# EAGLE design Efield1A (EAGLE 6.3)
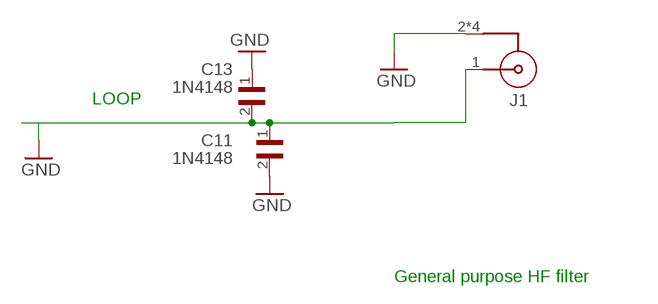
[diagram p0: schematic, sheet 1]

## Parts
C11  1N4148  WCAP-CSGP_0805-REFLOW  [WCAP-CSGP_0805_REFLOW]
C13  1N4148  WCAP-CSGP_0805-REFLOW  [WCAP-CSGP_0805_REFLOW]
J1  60312202114509  [60312202114509]

## Nets
GND: C11.1 C11.2 C13.1 C13.2 J1.1 J1.2 J1.3 J1.4 J1.5

## Notes on the sheet
- LOOP
- General purpose HF filter

## Library data of the parts
C11 C13 = Eagle_Wurth_Elektronik_Passive_Capacitors_rev15a:WCAP-CSGP: WCAP-CSGP Ceramic Capacitors Characteristics Multilayer Ceramic Chip Capacitor Recommended soldering:Reflow, for 0603 and 0805 wave soldering is also allowed Operating temperature:-55 °C to +125 °C; Ceramic characteristics: Class I - NPO ; Class II -X7R, X5R High performance ceramic High capacitance stability Minimal aging Termination:Cu/Ni/Sn <http://katalog.we-online.de/media/images/eisos/WCAP-CSGP_pf2.jpg> Details see: http://katalog.we-online.de/en/pbs/WCAP-CSGP/?m Created: 2015-01-28 2015 (C) Wurth Elektronik
J1 = 60312202111527_Eagle_WR-SMA_rev19a:60312202114509: WR-SMA PCB End Launch Jack Round Post 1.6 mm MATERIAL PROPERTIES Insulator Material PTFE Insulator Color White Center Contact Material Beryllium Copper Center Contact Plating Gold, min. 0.76µm over Nickel Body Material Brass Body Plating Gold, min. 0.076µm over Nickel KIND PROPERTIES Interface MIL-STD-348 Connector Type SMA Gender Jack Orientation Type Straight GENERAL INFORMATION Operating Temperature -65 °C up to +165 °C Compliance RoHS ELECTRICAL PROPERTIES Frequency Range DC~18 GHz MECHANICAL PROPERTIES Mating Cycle 500 Cycles PACKAGING PROPERTIES Packaging Tray <https://katalog.we-online.com/media/images/v2/o122849v209%20WR-SMA_60312202114509.jpg> Details see: https://katalog.we-online.com/en/em/WR-SMA_60312202114509 Updated by Ella Wu 2019-11-07 2019(C) Würth Elektronik; DATASHEET-URL: https://katalog.we-online.com/em/datasheet/60312202114509.pdf; GENDER: Jack; INTERFACE: MIL-STD-348; MOUNT: End Launch; ORIENTATION-TYPE: Straight; PART-NUMBER: 60312202114509; Z: 50Ohm

## Board
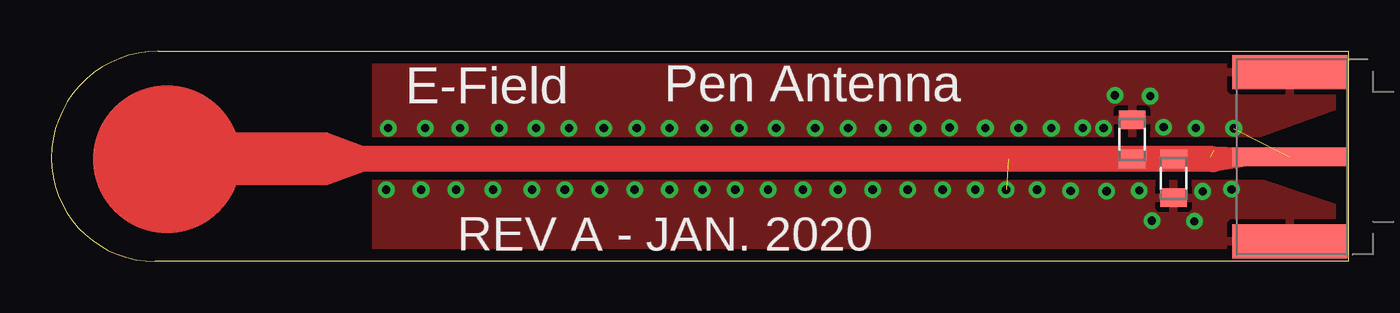
[diagram p1: board, top side]
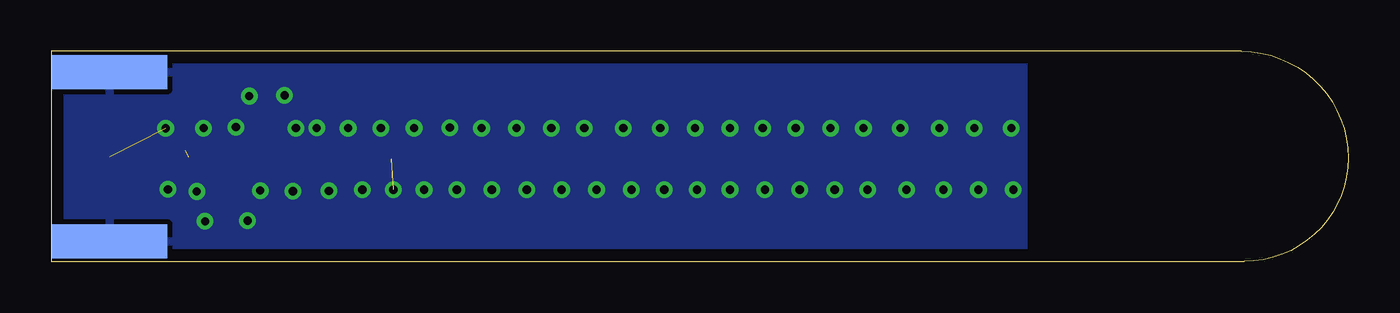
[diagram p2: board, bottom side, seen from below]

Size 63.17 x 10.25 mm. Coordinates in mm from the lower left corner, seen from the top.
Outline: 63.16,0 5.05,0 arc-90 0,5.04 arc-90 5.21,10.25 63.17,10.25 63.17,0.01
Copper layers (1*16): Top 0.035mm / dielectric 1.5mm / Bottom 0.035mm
Design rules "default *": minimum track width 0.2mm, minimum drill 0.3mm, track to track 0.15mm, track to pad 0.15mm, pad to pad 0.15mm, via to via 0.15mm, smd to smd 0.15mm, copper to edge 0.6mm, drill to drill 8mil, minimum pad ring 10mil, minimum via ring 8mil, stop-mask expansion 4mil, vias tented up to drill 0mil, thermal gap 10mil
tRestrict: 3 lines

### Footprints (pad centres in the part's own frame; a part is rotated, then mirrored left to right if it is on the bottom)
WCAP-CSGP_0805_REFLOW = smd 0.9 x 1.3: 1 -0.95,0; 2 0.95,0
60312202114509 = smd 0.9 x 5.6: 1 0,0 | smd 1.65 x 5.6: 2 -4.125,0; 3 4.125,0 | smd 1.65 x 5.6 bottom: 4 -4.125,0; 5 4.125,0

### Placement (x,y rotation side)
C11  52.64,5.96 90 top
C13  54.66,4.05 90 top
J1  60.31,5.11 90 top

### Tracks (layer width: path | path; a pad name or v marks a point on that pad's centre or on a via)
GND  (via drill 0.4 pad 0.41)  (2 unrouted)
  Top 0.305: C11.1 C13.2 46.56,5.05 46.61,5
  Top 1.27: 56.58,4.99 46.61,5 12.81,5
  other vias: 16.31,3.5 18.01,3.5 19.71,3.5 21.51,3.5 23.41,3.5 25.01,3.5 26.71,3.5 28.41,3.5 30.11,3.5 25.21,6.5 16.41,6.5 18.21,6.5 19.91,6.5 21.81,6.5 23.61,6.5 26.91,6.5 31.71,3.5 33.31,3.5 34.91,3.5 36.61,3.5 38.31,3.5 40.01,3.5 41.71,3.5 43.41,3.5 45.01,3.5 46.51,3.5 48.01,3.5 28.51,6.5 30.11,6.5 31.81,6.5 33.51,6.5 35.31,6.5 37.21,6.5 38.81,6.5 40.51,6.5 42.21,6.5 43.75,6.52 45.5,6.5 47.11,6.5 48.71,6.5 55.75,6.5 57.59,6.49 57.49,3.52 51.81,8.11 50.24,6.51 56.08,3.41 51.4,3.43 52.99,3.46 53.53,8.07 49.65,3.44 53.61,1.99 54.17,6.55 51.25,6.5 55.67,1.96
  pour Top (isolate 0.3): 15.81,9.88 15.81,0.06 63.06,0.21 62.92,10.14
  pour Bottom (isolate 0.3): 15.81,9.95 15.81,0.21 63.47,0.12 63.05,7.33 62.95,10.23
N$1  (1 unrouted)
  Top 0.406: 56.61,5.42 58.53,5.33 | 56.48,5.11 58.34,4.91
N$2
  Top 0.406: 56.61,4.58 58.45,4.88
N$3
  Top 0.8: 13.41,5.87 15.22,5.18
N$4
  Top 0.8: 13.43,4.14 15.09,4.74
(copper drawn outside any net)
  shapes: Top area x1, Top circle x1

### Text on the board
tNames: E-Field | Pen Antenna | REV A - JAN. 2020
201bmp: C:/Users/sylvain.lebras/Documents/eagle/Logo.bmp